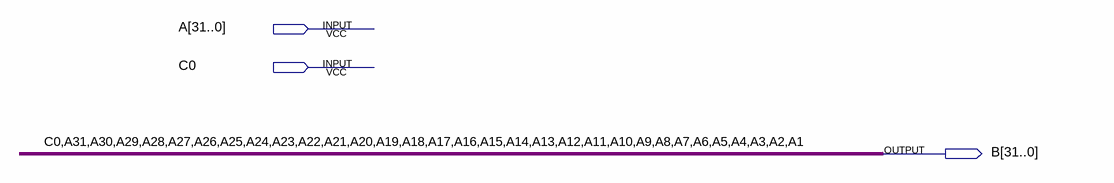
[diagram p0: schematic sheet]
// Quartus schematic SR_32BIT.bdf as structural Verilog: 0 symbols, 3 pins
module SR_32BIT (
  input  [31:0] A,
  input  C0,
  output [31:0] B
);


  assign B = {C0, A[31:1]};
endmodule
